# Altium schematic sheet WTDP.SchDoc
size A4
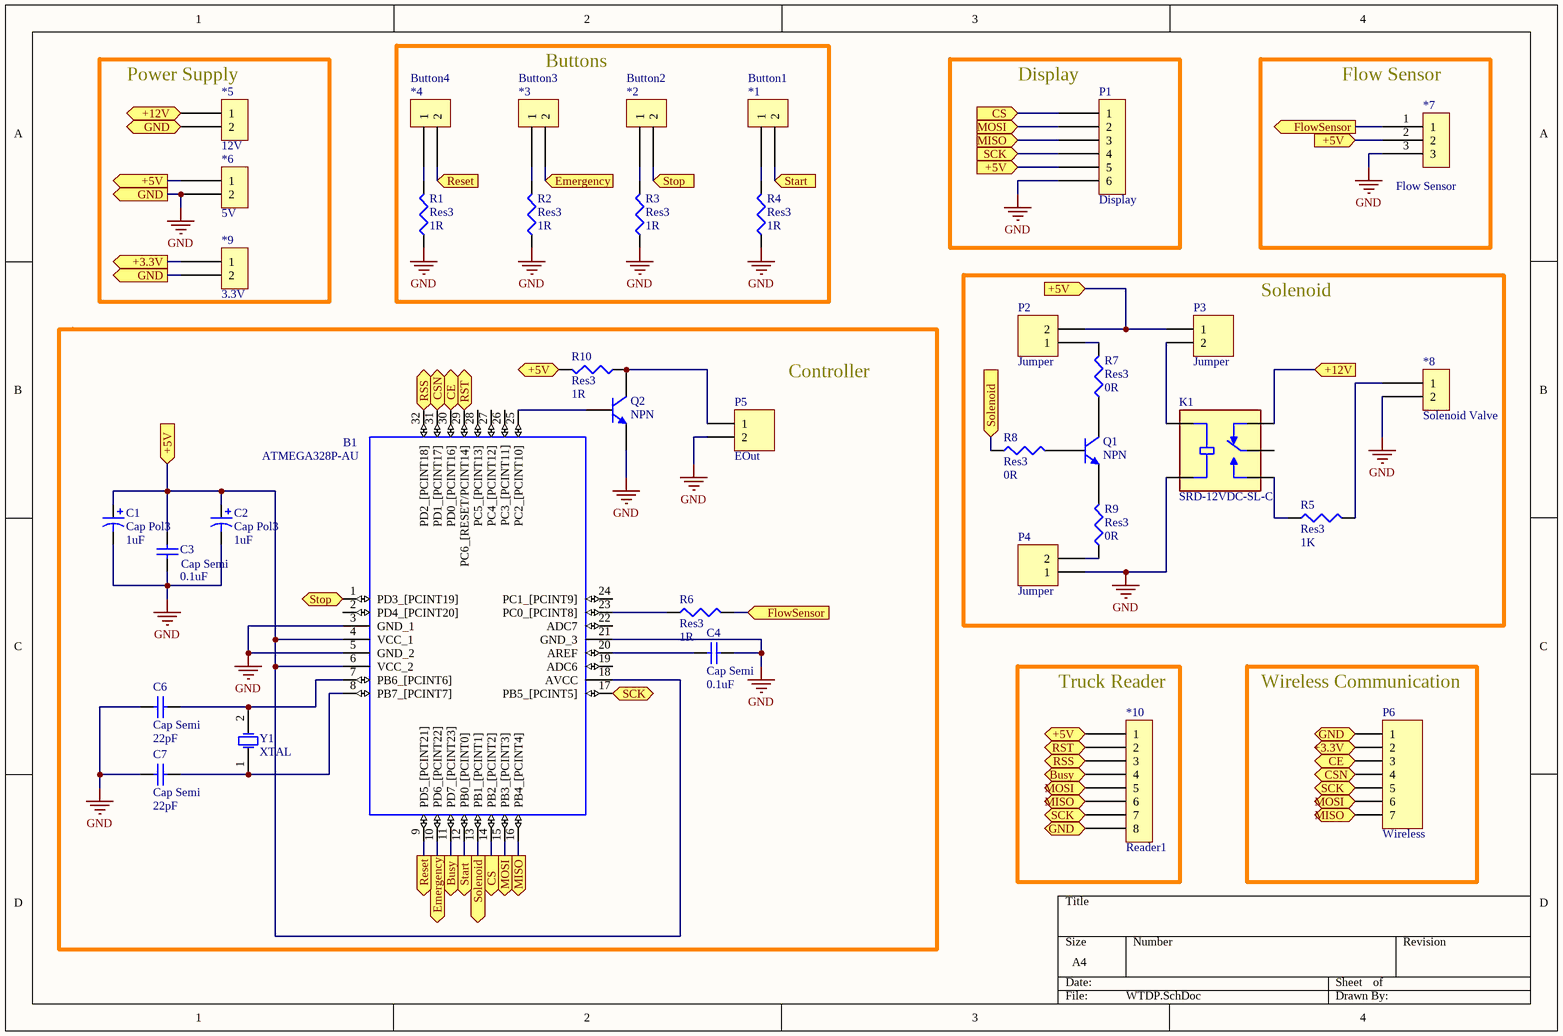
[diagram p0: WTDP.SchDoc]

## Parts
*1  Button1  [HDR1X2]
*2  Button2  [HDR1X2]
*3  Button3  [HDR1X2]
*4  Button4  [HDR1X2]
*5  12V  [HDR1X2]  (net tie, no BOM)
*6  5V  [HDR1X2]
*7  Flow Sensor  [HDR1X3]
*8  Solenoid Valve  [HDR1X2]
*9  3.3V  [HDR1X2]
*10  Reader1  [HDR1X8]
B1  ATMEGA328P-AU  [QFP80P900X900X120-32N]
C1  Cap Pol3  value 1uF  [C0805]
C2  Cap Pol3  value 1uF  [C0805]
C3  Cap Semi  value 0.1uF  [1608[0603]]
C4  Cap Semi  value 0.1uF  [1608[0603]]
C6  Cap Semi  value 22pF  [1608[0603]]
C7  Cap Semi  value 22pF  [1608[0603]]
K1  SRD-12VDC-SL-C  [RELAY_SRD-12VDC-SL-C]
P1  Display  [HDR1X6]
P2  Jumper  [HDR1X2]
P3  Jumper  [HDR1X2]
P4  Jumper  [HDR1X2]
P5  EOut  [HDR1X2]
P6  Wireless  [HDR1X7]
Q1  NPN  [TO-226-AA]
Q2  NPN  [TO-226-AA]
R1  Res3  value 1R  [J1-0603]
R2  Res3  value 1R  [J1-0603]
R3  Res3  value 1R  [J1-0603]
R4  Res3  value 1R  [J1-0603]
R5  Res3  value 1K  [J1-0603]
R6  Res3  value 1R  [J1-0603]
R7  Res3  value 0R  [J1-0603]
R8  Res3  value 0R  [J1-0603]
R9  Res3  value 0R  [J1-0603]
R10  Res3  value 1R  [J1-0603]
Y1  XTAL  [R38]

## Blocks framed on the sheet
Power Supply: *5 *6 *9
Buttons: *1-*4 R1-R4
Display: P1
Flow Sensor: *7
Solenoid: *8 K1 P2-P4 Q1 R5 R7-R9
Controller: B1 C1-C4 C6 C7 P5 Q2 R6 R10 Y1
Truck Reader: *10
Wireless Communication: P6

## Ports
+3.3V (in), +3.3V (out), +5V (in), +5V (out), +12V (in), +12V (out), Busy (in), Busy (out), CE (in), CE (out), CS (in), CS (out), CSN (in), CSN (out), Emergency (in), Emergency (out), FlowSensor (in), FlowSensor (out), GND (in), GND (out), MISO (in), MISO (out), MOSI (in), MOSI (out), Reset (in), Reset (out), RSS (in), RSS (out), RST (in), RST (out), SCK (in), SCK (out), Solenoid (in), Solenoid (out), Start (in), Start (out), Stop (in), Stop (out)

## Nets
GND: *5.2 *6.2 *7.3 *8.2 *9.2 *10.8 B1.3(GND_1) B1.5(GND_2) B1.21(GND_3) C1.2 C2.2 C3.1 C4.2 C6.1 C7.1 K1.COIL2 P1.6 P4.1 P5.2 P6.1 Q2.3(E) R1.1 R2.1 R3.1 R4.1 ; port GND
+3.3V: *9.1 P6.2 ; port +3.3V
+5V: *6.1 *7.2 *10.1 B1.4(VCC_1) B1.6(VCC_2) B1.18(AVCC) C1.1 C2.1 C3.2 P1.5 P2.2 P3.1 R10.2 ; port +5V
+12V: *5.1 K1.NC ; port +12V
Busy: *10.4 B1.11(PD7_[PCINT23]) ; port Busy
CE: B1.30(PD0_[PCINT16]) P6.3 ; port CE
CS: B1.14(PB2_[PCINT2]) P1.1 ; port CS
CSN: B1.31(PD1_[PCINT17]) P6.4 ; port CSN
Emergency: *3.2 B1.10(PD6_[PCINT22]) ; port Emergency
FlowSensor: *7.1 R6.2 ; port FlowSensor
MISO: *10.6 B1.16(PB4_[PCINT4]) P1.3 P6.7 ; port MISO
MOSI: *10.5 B1.15(PB3_[PCINT3]) P1.2 P6.6 ; port MOSI
Reset: *4.2 B1.9(PD5_[PCINT21]) ; port Reset
RSS: *10.3 B1.32(PD2_[PCINT18]) ; port RSS
RST: *10.2 B1.29(PC6_[RESET/PCINT14]) ; port RST
SCK: *10.7 B1.17(PB5_[PCINT5]) P1.4 P6.5 ; port SCK
Solenoid: B1.13(PB1_[PCINT1]) R8.1 ; port Solenoid
Start: *1.2 B1.12(PB0_[PCINT0]) ; port Start
Stop: *2.2 B1.1(PD3_[PCINT19]) ; port Stop
Net*1_1: *1.1 R4.2
Net*2_1: *2.1 R3.2
Net*3_1: *3.1 R2.2
Net*4_1: *4.1 R1.2
Net*8_1: *8.1 R5.2
NetB1_7: B1.7(PB6_[PCINT6]) C6.2 Y1.2(OSC2)
NetB1_8: B1.8(PB7_[PCINT7]) C7.2 Y1.1(OSC1)
NetB1_20: B1.20(AREF) C4.1
NetB1_23: B1.23(PC0_[PCINT8]) R6.1
NetB1_25: B1.25(PC2_[PCINT10]) Q2.2(B)
NetK1_COIL1: K1.COIL1 P3.2
NetK1_NO: K1.NO R5.1
NetP2_1: P2.1 R7.2
NetP4_2: P4.2 R9.1
NetP5_1: P5.1 Q2.1(C) R10.1
NetQ1_1: Q1.1(C) R7.1
NetQ1_2: Q1.2(B) R8.2
NetQ1_3: Q1.3(E) R9.2

Not connected (* = marked no-connect by the designer): B1 2(PD4_[PCINT20]) 19(ADC6) 22(ADC7) 24(PC1_[PCINT9]) 26(PC3_[PCINT11]) 27(PC4_[PCINT12]) 28(PC5_[PCINT13]); K1 COM

## Library data of the parts
*1-*6 *8 *9 = Header 2x1
*7 = Header 1x3
*10 = Header 1x8
B1 = ATMEGA328P-AU: MICROCHIP - ATMEGA328P-AU. - MICROCONTROLLER MCU, 8 BIT, ATMEGA, 20MHZ, TQFP-32; Geometry.Height: 1.2mm; Manufacturer_Name: Microchip; Manufacturer_Part_Number: ATMEGA328P-AU; RS Part Number: 1310271; RS Price/Stock: http://uk.rs-online.com/web/p/products/1310271; Mouser Part Number: 556-ATMEGA328P-AU; Mouser Price/Stock: https://www.mouser.com/Search/Refine.aspx?Keyword=556-ATMEGA328P-AU; Datasheet Link: https://componentsearchengine.com/Datasheets/2/ATMEGA328P-AU.pdf
C1 C2 = Cap Pol3: Polarized Capacitor (Surface Mount); Published: 8-Jun-2000; LatestRevisionDate: 29-May-2009; LatestRevisionNote: IPC-7351 Footprint Added.; PackageReference: C0805; Publisher: Altium Limited; PackageDescription: Chip Capacitor
C3 C4 C6 C7 = Cap Semi: Capacitor (Semiconductor SIM Model); Published: 8-Jun-2000; LatestRevisionDate: 29-May-2009; LatestRevisionNote: IPC-7351 Footprint Added.; PackageReference: C1206; Publisher: Altium Limited; PackageDescription: Chip Capacitor
K1 = SRD-12VDC-SL-C: General Purpose Non Latching 12VDC SPDT Through Hole Relays RoHS; MF: Songle Relay; SnapEDA_Link: https://www.snapeda.com/parts/SRD-12VDC-SL-C/Songle+Relay/view-part/?ref=snap; Package: NON STANDARD-5 Songle Relay; Value: *; MP: SRD-12VDC-SL-C; Check_prices: https://www.snapeda.com/parts/SRD-12VDC-SL-C/Songle+Relay/view-part/?ref=eda
P1 = Header 1x6
P2-P5 = Header 2: Header, 2-Pin; LatestRevisionDate: 17-Jul-2002; LatestRevisionNote: Re-released for DXP Platform.; Publisher: Altium Limited
P6 = Header 7: Header, 7-Pin; LatestRevisionDate: 17-Jul-2002; LatestRevisionNote: Re-released for DXP Platform.; Publisher: Altium Limited
Q1 Q2 = NPN: NPN Bipolar Transistor; Published: 8-Jun-2000; LatestRevisionDate: 17-Jul-2002; LatestRevisionNote: Re-released for DXP Platform.; PackageReference: TO-226-AA; Publisher: Altium Limited; PackageDescription: TO, Flat Index; 3 In-Line, Axial Leads; Body Dia. 4.8mm; Leads 0.55 x 0.51 mm (max); Code_JEDEC: TO-226-AA
R1-R10 = Res3: Resistor; Published: 8-Jun-2000; LatestRevisionDate: 29-May-2009; LatestRevisionNote: IPC-7351 Footprint Added.; PackageReference: J1-0603; Publisher: Altium Limited; PackageDescription: Chip Resistor
Y1 = XTAL: Crystal Oscillator; Published: 8-Jun-2000; LatestRevisionDate: 17-Jul-2002; LatestRevisionNote: Re-released for DXP Platform.; PackageReference: R38; Publisher: Altium Limited; PackageDescription: Crystal, Thru-Hole; 2 Leads; Body 3.1 x 8.2 mm (Dia.xH)